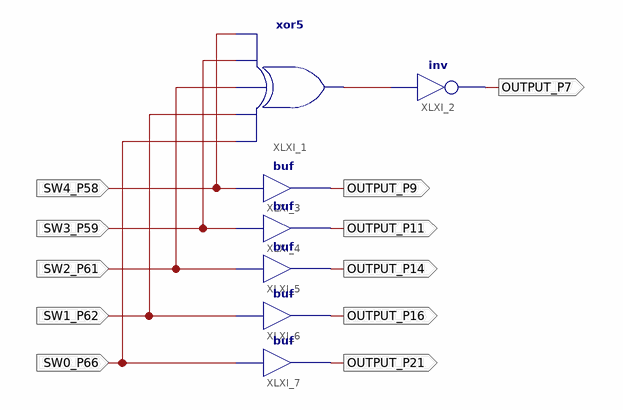
[diagram p0: schematic sheet 1]
// Xilinx ISE schematic Lab5_3S.sch (spartan6) as structural Verilog: 7 symbols, 11 ports
module Lab5_3S (
  input  SW4_P58,
  input  SW3_P59,
  input  SW1_P62,
  input  SW0_P66,
  input  SW2_P61,
  output OUTPUT_P9,
  output OUTPUT_P11,
  output OUTPUT_P14,
  output OUTPUT_P16,
  output OUTPUT_P21,
  output OUTPUT_P7
);

  wire XLXN_12;

  xor XLXI_1 (XLXN_12, SW0_P66, SW1_P62, SW2_P61, SW3_P59, SW4_P58);
  not XLXI_2 (OUTPUT_P7, XLXN_12);
  buf XLXI_3 (OUTPUT_P9, SW4_P58);
  buf XLXI_4 (OUTPUT_P11, SW3_P59);
  buf XLXI_5 (OUTPUT_P14, SW2_P61);
  buf XLXI_6 (OUTPUT_P16, SW1_P62);
  buf XLXI_7 (OUTPUT_P21, SW0_P66);
endmodule
